# EAGLE design Fonte_de_Tensão (EAGLE 9.6.2)
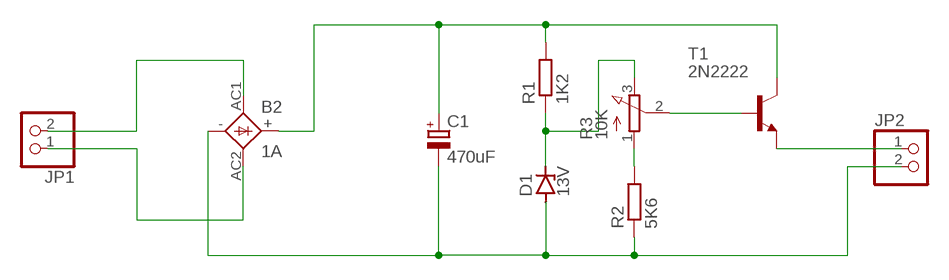
[diagram p0: schematic, sheet 1]

## Parts
B2  1A  GBPC1  [GBPC1]
C1  470uF  CPOL-EUE3.5-10  [E3,5-10]
D1  13V  ZENER-DIODEDO35Z10  [DO35Z10]
JP1  PINHD-1X2  [1X02]
JP2  PINHD-1X2  [1X02]
R1  1K2  R-EU_0309/12  [0309/12]
R2  5K6  R-EU_0309/12  [0309/12]
R3  10K  3RP/1610N  [3RP/1610N]
T1  2N2222  [TO18]

## Nets
N$1: B2.AC1 JP1.2
N$2: B2.AC2 JP1.1
N$3: B2.+ C1.+ R1.2 T1.3(C)
N$4: B2.- C1.- D1.A JP2.2 R2.1
N$5: JP2.1 T1.1(E)
N$7: R3.2(S) T1.2(B)
N$8: R2.2 R3.1(A)
N$9: D1.C R1.1 R3.3(E)

## Library data of the parts
B2 = rectifier:GBPC1: GENERAL INSTRUMENT RECTIFIER
C1 = rcl:CPOL-EU: POLARIZED CAPACITOR, European symbol; SPICEPREFIX: C
D1 = diode:ZENER-DIODE: Z-Diode
JP1 JP2 = pinhead:PINHD-1X2: PIN HEADER
R1 R2 = rcl:R-EU_: RESISTOR, European symbol; SPICEPREFIX: R
R3 = pot:3RP/1610N: 16mm Potentiometer one level Source: http://www.alphapotentiometers.net/html/16mm_pot_2.html
T1 = transistor-neu-to92:2N2222: NPN TRANSISTOR

## Board
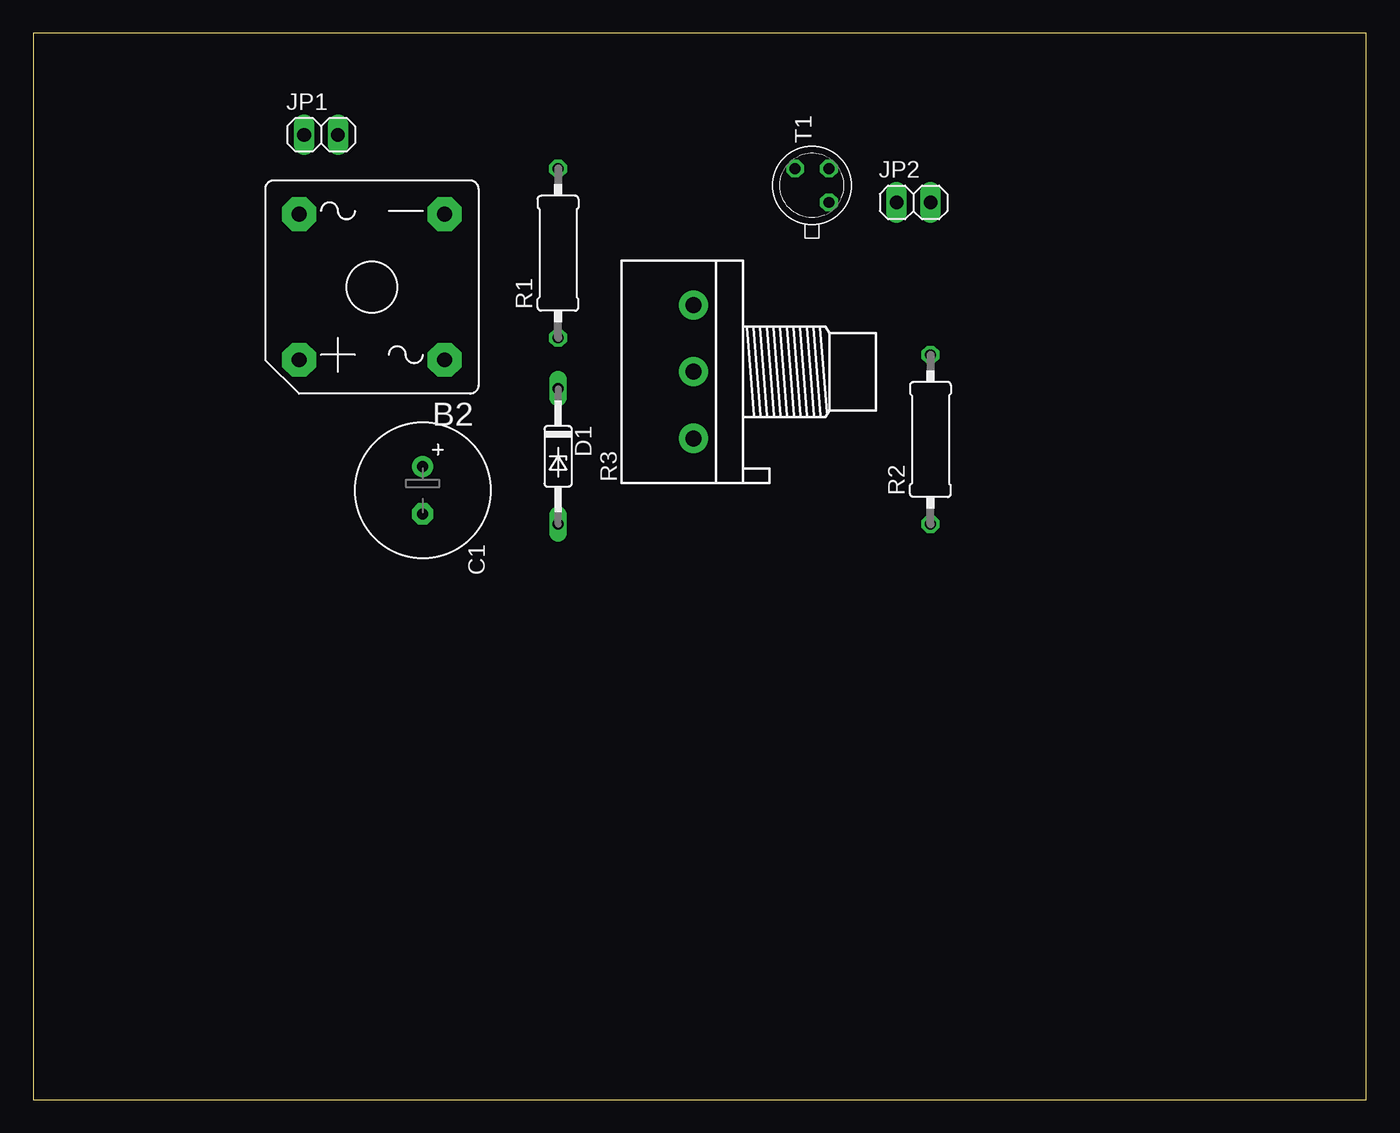
[diagram p1: board, top side]
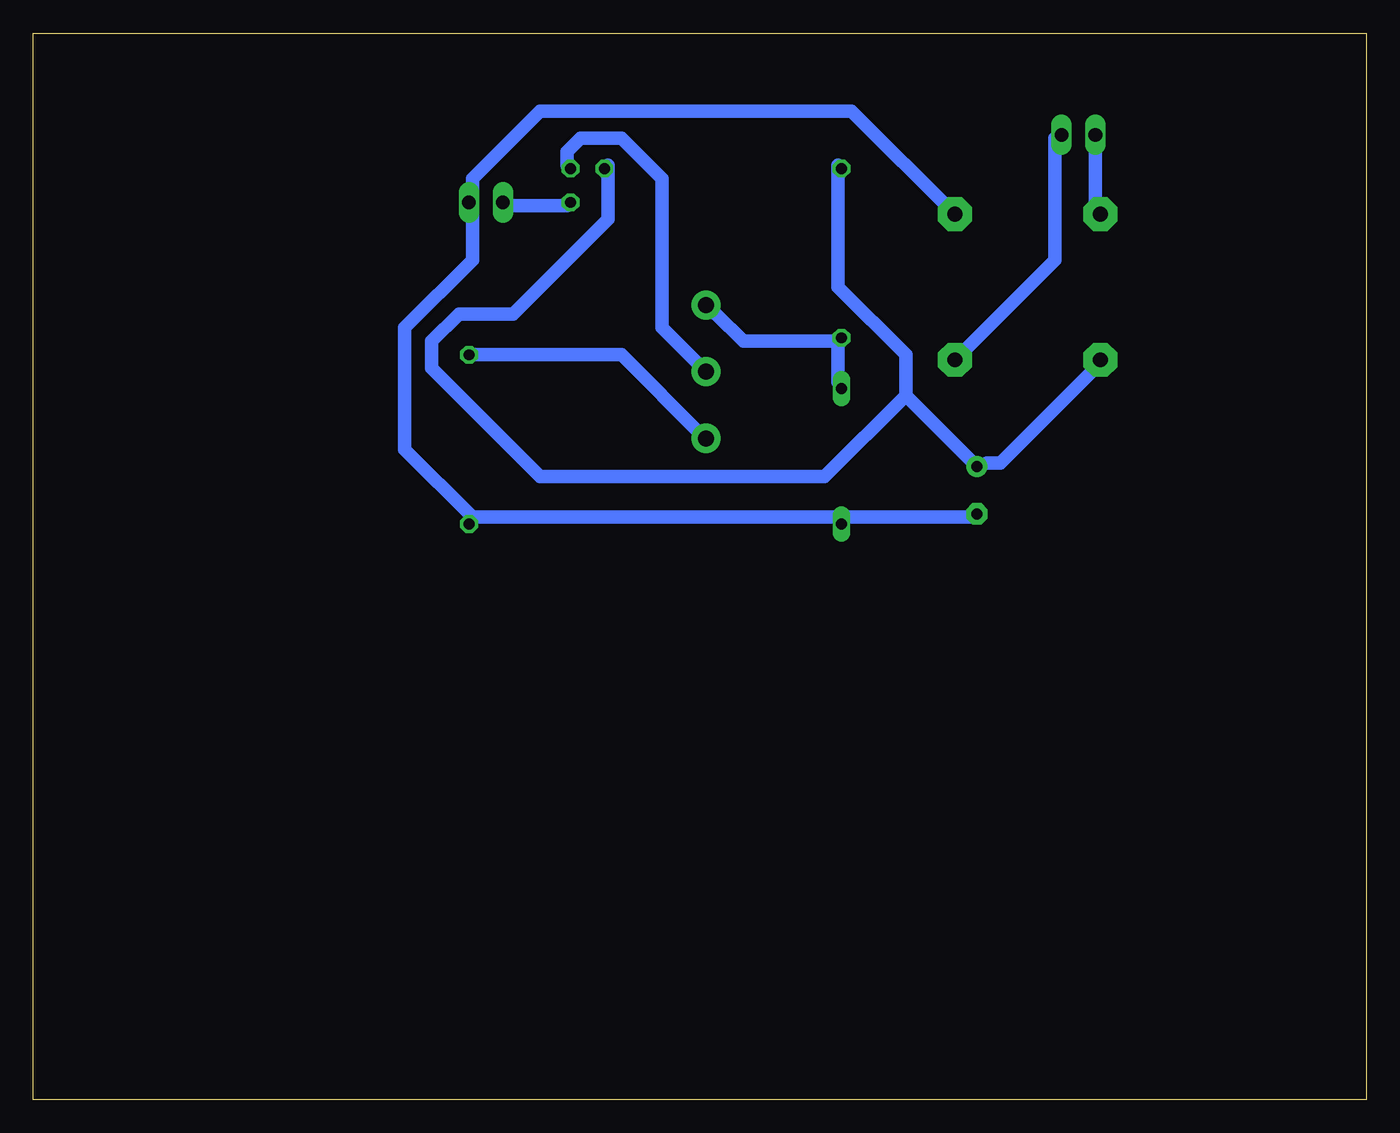
[diagram p2: board, bottom side, seen from below]

Size 100 x 80 mm. Coordinates in mm from the lower left corner, seen from the top.
Outline: 0,0 100,0 100,80 0,80 0,0
Copper layers (1*16): Top 0.035mm / dielectric 1.5mm / Bottom 0.035mm
Design rules "default *": minimum track width 40mil, minimum drill 0.35mm, track to track 40mil, track to pad 40mil, pad to pad 40mil, via to via 40mil, smd to smd 6mil, copper to edge 40mil, drill to drill 6mil, minimum pad ring 10mil, minimum via ring 8mil, stop-mask expansion 4mil, vias tented up to drill 0mil, thermal gap 10mil

### Footprints (pad centres in the part's own frame; a part is rotated, then mirrored left to right if it is on the bottom)
GBPC1 = drill 1.118 pad 2.54 octagon: + 5.461,5.461; - -5.461,-5.461; AC1 -5.461,5.461; AC2 5.461,-5.461
E3,5-10 = drill 0.813 pad 1.6: + -1.778,0 | drill 0.813 pad 1.6 octagon: - 1.778,0
DO35Z10 = drill 0.813 long: A 5.08,0; C -5.08,0
1X02 = drill 1.016 long: 1 -1.27,0; 2 1.27,0
0309/12 = drill 0.813 octagon: 1 -6.35,0; 2 6.35,0
3RP/1610N = drill 1.2 pad 2.184: 1 -5,0; 2 0,0; 3 5,0
TO18 = drill 0.813 octagon: 1 -1.27,-1.27; 2 1.27,-1.27; 3 1.27,1.27

### Placement (x,y rotation side)
B2  25.4,60.96 180 top
C1  29.21,45.72 270 top
D1  39.37,48.26 270 top
JP1  21.59,72.39 0 top
JP2  66.04,67.31 0 top
R1  39.37,63.5 90 top
R2  67.31,49.53 90 top
R3  49.53,54.61 90 top
T1  58.42,68.58 90 top

### Tracks (layer width: path | path; a pad name or v marks a point on that pad's centre or on a via)
N$1
  Bottom 1.016: B2.AC1 23.37,62.99 23.37,72.14 JP1.2
N$2
  Bottom 1.016: JP1.1 20.32,67.06 B2.AC2
N$3
  Bottom 1.016: 34.54,52.83 34.54,55.88 39.62,60.96 39.62,70.1 R1.2 | 34.54,52.83 C1.+ 28.45,47.75 27.43,47.75 20.32,54.86 B2.+ | 34.54,52.83 40.64,46.74 61.98,46.74 70.1,54.86 70.1,56.9 68.07,58.93 64.01,58.93 56.9,66.04 56.9,70.1 T1.3
N$4
  Bottom 1.016: 39.62,43.69 29.46,43.69 C1.- | 39.62,43.69 67.06,43.69 | 39.62,43.69 D1.A | 67.06,43.69 72.14,48.77 72.14,57.91 67.06,62.99 67.06,67.06 JP2.2 67.06,68.07 67.06,69.09 61.98,74.17 38.61,74.17 B2.- | 67.06,43.69 R2.1
N$5
  Bottom 1.016: T1.1 59.94,67.06 65.02,67.06 JP2.1
N$7
  Bottom 1.016: R3.2 52.83,57.91 52.83,69.09 55.88,72.14 58.93,72.14 59.94,71.12 59.94,70.1 T1.2
N$8
  Bottom 1.016: R2.2 55.88,55.88 49.78,49.78 R3.1
N$9
  Bottom 1.016: 39.62,56.9 39.62,53.85 D1.C | 39.62,56.9 46.74,56.9 48.77,58.93 R3.3 | 39.62,56.9 R1.1